# Altium project Trabajo Final.PrjPcb (part 2 of 4)

## Sheet supply.SchDoc
size A4
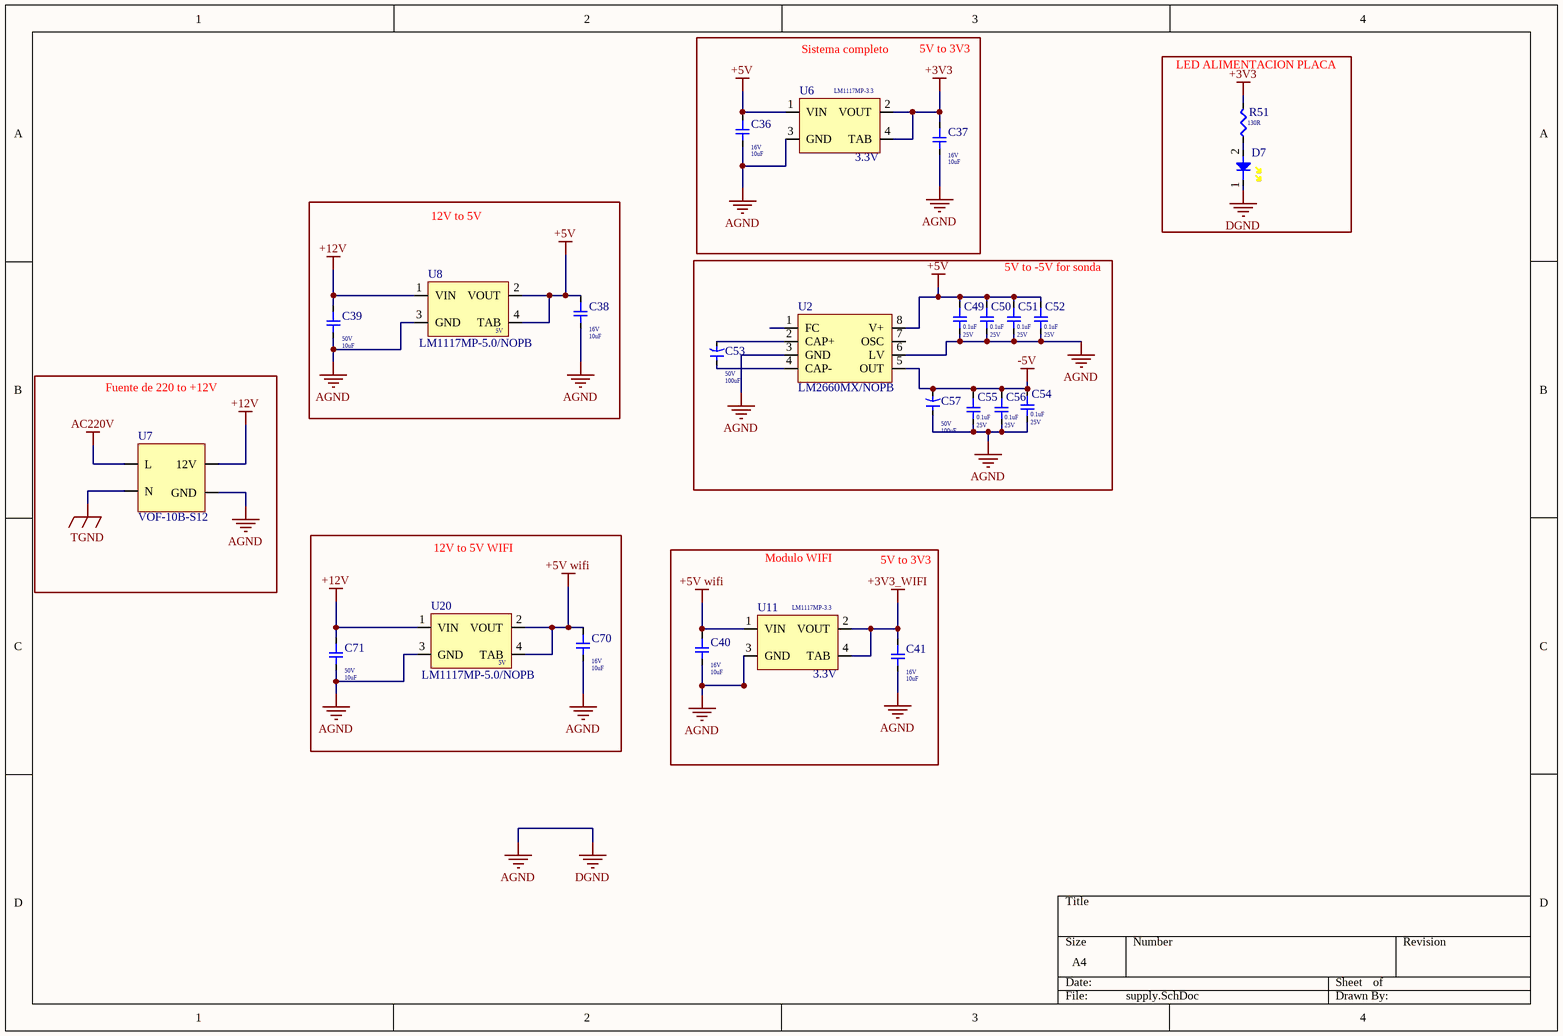
[diagram p1: supply.SchDoc]

### Parts
C36  Voltage Rating: 16V  Capacitance: 10uF  [CAP smd 0805 OK]  (hidden comment: CAP_CL21A106KOCL3RC)
C37  Voltage Rating: 16V  Capacitance: 10uF  [CAP smd 0805 OK]  (hidden comment: CAP_CL21A106KOCL3RC)
C38  Voltage Rating: 16V  Capacitance: 10uF  [CAP smd 0805 OK]  (hidden comment: CAP_CL21A106KOCL3RC)
C39  Voltage Rating: 50V  Capacitance: 10uF  [cap smd 1206 ok]  (hidden comment: CAP_CL31A106MBHNNNE)
C40  Voltage Rating: 16V  Capacitance: 10uF  [CAP smd 0805 OK]  (hidden comment: CAP_CL21A106KOCL3RC)
C41  Voltage Rating: 16V  Capacitance: 10uF  [CAP smd 0805 OK]  (hidden comment: CAP_CL21A106KOCL3RC)
C49  Voltage Rating: 25V  Capacitance: 0.1uF  [CAP smd 0805 ok]  (hidden comment: CAP_CC0805KRX7R8BB104_YAGEO)
C50  Voltage Rating: 25V  Capacitance: 0.1uF  [CAP smd 0805 ok]  (hidden comment: CAP_CC0805KRX7R8BB104_YAGEO)
C51  Voltage Rating: 25V  Capacitance: 0.1uF  [CAP smd 0805 ok]  (hidden comment: CAP_CC0805KRX7R8BB104_YAGEO)
C52  Voltage Rating: 25V  Capacitance: 0.1uF  [CAP smd 0805 ok]  (hidden comment: CAP_CC0805KRX7R8BB104_YAGEO)
C53  Voltage: 50V  Capacitance: 100uF  [cap elec 8x11.5 ok]  (hidden comment: CAP_ESY107M050AG3AA_KEMET)
C54  Voltage Rating: 25V  Capacitance: 0.1uF  [CAP smd 0805 ok]  (hidden comment: CAP_CC0805KRX7R8BB104_YAGEO)
C55  Voltage Rating: 25V  Capacitance: 0.1uF  [CAP smd 0805 ok]  (hidden comment: CAP_CC0805KRX7R8BB104_YAGEO)
C56  Voltage Rating: 25V  Capacitance: 0.1uF  [CAP smd 0805 ok]  (hidden comment: CAP_CC0805KRX7R8BB104_YAGEO)
C57  Voltage: 50V  Capacitance: 100uF  [cap elec 8x11.5 ok]  (hidden comment: CAP_ESY107M050AG3AA_KEMET)
C70  Voltage Rating: 16V  Capacitance: 10uF  [CAP smd 0805 OK]  (hidden comment: CAP_CL21A106KOCL3RC)
C71  Voltage Rating: 50V  Capacitance: 10uF  [cap smd 1206 ok]  (hidden comment: CAP_CL31A106MBHNNNE)
D7  150080YS75000  [Diode smd 0805 yellow ok]  (value not drawn)
R51  Resistance: 130R  [res 0805 ok]  (hidden comment: RC0805FR-07130RL)
U2  LM2660MX/NOPB  [LM2660MX/NOPB ok]
U6  LM1117MP-3.3  Max Output Voltage: 3.3V  [LM1117MP-3.3 ok]
U7  VOF-10B-S12  [12v]
U8  Output Voltage: 5V  [LM1117MP-5.0/NOPB ok]
U11  LM1117MP-3.3  Max Output Voltage: 3.3V  [LM1117MP-3.3 ok]
U20  Output Voltage: 5V  [LM1117MP-5.0/NOPB ok]

### Blocks framed on the sheet
LED ALIMENTACION PLACA: D7 R51
12V to 5V: C38 C39 U8
5V to -5V for sonda: C49-C57 U2
Fuente de 220 to +12V: U7
12V to 5V WIFI: C70 C71 U20

### Nets
+3V3: C37.23 R51.2 U6.2(VOUT) U6.4(TAB)
+3V3_WIFI: C41.23 U11.2(VOUT) U11.4(TAB)
+5V: C36.23 C38.23 C49.23 C50.23 C51.23 C52.23 U2.8(V+) U6.1(VIN) U8.2(VOUT) U8.4(TAB)
+5V wifi: C40.23 C70.23 U11.1(VIN) U20.2(VOUT) U20.4(TAB)
+12V: C39.23 C71.23 U7.3(12V) U8.1(VIN) U20.1(VIN)
-5V: C54.23 C55.23 C56.23 C57.25 U2.5(OUT)
AC220V: U7.2(L)
AGND: C36.22 C37.22 C38.22 C39.22 C40.22 C41.22 C49.22 C50.22 C51.22 C52.22 C54.22 C55.22 C56.22 C57.24 C70.22 C71.22 D7.1 U2.3(GND) U2.6(LV) U6.3(GND) U7.4(GND) U8.3(GND) U11.3(GND) U20.3(GND)  [also labelled DGND]
TGND: U7.1(N)
NetC53_24: C53.24 U2.4(CAP-)
NetC53_25: C53.25 U2.2(CAP+)
NetD7_2: D7.2 R51.1

Not connected (* = marked no-connect by the designer): U2 1(FC) 7(OSC)

### Notes on the sheet
- Sistema completo
- 5V to 3V3
- Modulo WIFI

### Library data of the parts
C36-C38 C40 C41 C70 = CAP_CL21A106KOCL3RC: CAP CER 10UF 16V X5R 0805; Manufacturer 1: Samsung; Tolerance: 10%; Supplier 1: Digi-Key; Manufacturer Part Number 1: CL21A106KOCL3RC; Stock 1: 0; RoHS: Yes; Mount: Surface Mount; Case/Package: 0805; Case Code (Metric): 2012; Case Code (Imperial): 0805; Min Operating Temperature: -55°C; Max Operating Temperature: 85°C; Package Quantity: 1; Packaging: Tape and Reel; Series: CL; Length: 0.079inch; Width: 0.049inch; Thickness: 0.037inch; RoHS Compliant: Yes; ComponentLink1URL: https://datasheet.ciiva.com/25796/cl21a106kocl3rc-25796224.pdf?src-supplier=Digi-Key; ComponentLink1Description: https://datasheet.ciiva.com/25796/cl21a106kocl3rc-25796224.pdf?src-supplier=Digi-Key; Supplier Part Number 1: 1276-2398-2-ND
C39 C71 = CAP_CL31A106MBHNNNE: Cap Ceramic 10uF 50V X5R 20% Pad SMD 1206 85°C T/R; Manufacturer 1: Samsung; Supplier 1: Digi-Key; Manufacturer Part Number 1: CL31A106MBHNNNE; Stock 1: 1423422; Pricing 1: 1=0,31000, 10=0,21300, 50=0,14200, 100=0,12070, 500=0,08520, 1000=0,07455 (USD); RoHS: Yes; Mount: Surface Mount; Case/Package: 1206; Case Code (Metric): 3216; Case Code (Imperial): 1206; Min Operating Temperature: -55°C; Max Operating Temperature: 85°C; Packaging: Tape and Reel; Tolerance: 20%; Dielectric: X5R; Voltage Rating (DC): 50V; Length: 0.126inch; Width: 0.063inch; Thickness: 0.071inch; RoHS Compliant: Yes; ComponentLink1URL: http://www.samsungsem.com/kr/support/product-search/mlcc/CL31A106MBHNNNE.jsp?src-supplier=Digi-Key; ComponentLink1Description: http://www.samsungsem.com/kr/support/product-search/mlcc/CL31A106MBHNNNE.jsp?src-supplier=Digi-Key; Supplier Part Number 1: 1276-6736-1-ND
C49-C52 C54-C56 = CAP_CC0805KRX7R8BB104_YAGEO: CAPACITOR, 0805, 100NF, 25V, REEL 4000; Manufacturer 1: Yageo; Material: Ceramic; Tolerance: 10%; Dielectric: X7R; Insulation Resistance: 100GR; Supplier 1: Digi-Key; Manufacturer Part Number 1: CC0805KRX7R8BB104; Stock 1: 278639; Pricing 1: 1=0,12000, 10=0,08800, 50=0,04980, 100=0,04130, 500=0,02894, 1000=0,02396 (USD); RoHS: Yes; Mount: Surface Mount; Case/Package: 0805; Number of Pins: 2; Case Code (Metric): 2012; Case Code (Imperial): 0805; Min Operating Temperature: -55°C; Max Operating Temperature: 125°C; Package Quantity: 1; Packaging: Tape and Reel; Voltage Rating (DC): 25V; Termination: SMD/SMT; Resistor Type: Ceramic; Series: CC; Length: 2mm; Width: 0.049inch; Height: 0.85mm; Thickness: 0.033inch; Depth: 1.25mm; Radiation Hardening: No; REACH SVHC: No SVHC; Lead Free: Lead Free; Halogen Free: Halogen Free; RoHS Compliant: Yes; ComponentLink1URL: https://datasheet.ciiva.com/8034/70765-8034031.pdf?src-supplier=Element14; ComponentLink1Description: https://datasheet.ciiva.com/8034/70765-8034031.pdf?src-supplier=Element14; ComponentLink2URL: https://datasheet.ciiva.com/28450/1489800-28450789.pdf?src-supplier=Element14; ComponentLink2Description: https://datasheet.ciiva.com/28450/1489800-28450789.pdf?src-supplier=Element14; ComponentLink3URL: https://datasheet.ciiva.com/46430/1850775-46430166.pdf?src-supplier=Element14; ComponentLink3Description: https://datasheet.ciiva.com/46430/1850775-46430166.pdf?src-supplier=Element14; ComponentLink4URL: https://datasheet.ciiva.com/145/mlccorderingcode-145008.pdf?src-supplier=Digi-Key; ComponentLink4Description: https://datasheet.ciiva.com/145/mlccorderingcode-145008.pdf?src-supplier=Digi-Key; ComponentLink5URL: https://datasheet.ciiva.com/145/mlccorderingcode-145007.pdf?src-supplier=Digi-Key; ComponentLink5Description: https://datasheet.ciiva.com/145/mlccorderingcode-145007.pdf?src-supplier=Digi-Key; ComponentLink6URL: https://datasheet.ciiva.com/145/mlccorderingcode-145009.pdf?src-supplier=Digi-Key; ComponentLink6Description: https://datasheet.ciiva.com/145/mlccorderingcode-145009.pdf?src-supplier=Digi-Key; ComponentLink7URL: https://datasheet.ciiva.com/8034/1784427-8034030.pdf?src-supplier=Element14; ComponentLink7Description: https://datasheet.ciiva.com/8034/1784427-8034030.pdf?src-supplier=Element14; ComponentLink8URL: https://datasheet.ciiva.com/8034/1784427-8034029.pdf?src-supplier=Element14; ComponentLink8Description: https://datasheet.ciiva.com/8034/1784427-8034029.pdf?src-supplier=Element14; ComponentLink9URL: https://datasheet.ciiva.com/15189/getdatasheetpartid-330244-15189223.pdf?src-supplier=Verical; ComponentLink9Description: https://datasheet.ciiva.com/15189/getdatasheetpartid-330244-15189223.pdf?src-supplier=Verical; ComponentLink10URL: https://datasheet.ciiva.com/16625/upy-gphc-x7r-6-3v-to-50v-8-16625546.pdf?src-supplier=Avnet+Europe; ComponentLink10Description: https://datasheet.ciiva.com/16625/upy-gphc-x7r-6-3v-to-50v-8-16625546.pdf?src-supplier=Avnet+Europe; Supplier Part Number 1: 311-1141-1-ND
C53 C57 = CAP_ESY107M050AG3AA_KEMET: KEMET - ESY107M050AG3AA - Elektrolytkondensator, 100 µF, 50 V, Produktreihe ESY, ± 20%, Radial bedrahtet, 8 mm; Dielectric Material: Aluminium; Ripple Current: 511mA; Life (Hours): 3000Hour; Leakage Current: 50uA; Dissipation Factor: 0.1%; Lead/Base Style: Straight; Impedance: 74mR; Lead Diameter: 0.6mm; Lead Length: 20mm; Supplier 1: Digi-Key; Manufacturer 1: KEMET; Manufacturer Part Number 1: ESY107M050AG3AA; Stock 1: 587; Pricing 1: 1=0,44000, 10=0,30700, 50=0,21500, 100=0,18420, 500=0,13818, 1000=0,11668, 2500=0,11054, 5000=0,10440 (USD); RoHS: Yes; Mount: Through Hole,PCB; Case/Package: Radial; Min Operating Temperature: -40°C; Max Operating Temperature: 105°C; Tolerance: 20%; Termination: Radial; Packaging: Bulk; Voltage Rating (DC): 50V; Package Quantity: 6000; Voltage Rating: 50V; Series: ESY; ESR (Equivalent Series Resistance): 74mR; Diameter: 8mm; Length: 11mm; Height: 11mm; Lead Pitch: 3.5mm; Height - Seated (Max): 0.492inch; Radiation Hardening: No; RoHS Compliant: Yes; ComponentLink1URL: http://www.farnell.com/datasheets/2751412.pdf?src-supplier=Farnell; ComponentLink1Description: http://www.farnell.com/datasheets/2751412.pdf?src-supplier=Farnell; ComponentLink2URL: http://www.mouser.com/ds/2/212/KEM_A4007_ESY-1103537.pdf?src-supplier=Mouser; ComponentLink2Description: http://www.mouser.com/ds/2/212/KEM_A4007_ESY-1103537.pdf?src-supplier=Mouser; ComponentLink3URL: http://components.arrow.com/part/dataview/0323_06946698?src-supplier=Arrow+Europe; ComponentLink3Description: http://components.arrow.com/part/dataview/0323_06946698?src-supplier=Arrow+Europe; ComponentLink4URL: https://www.alliedelec.com/m/d/2f7883d23207e2a46fd2b27bea013c02.pdf?src-supplier=Allied+Electronics; ComponentLink4Description: https://www.alliedelec.com/m/d/2f7883d23207e2a46fd2b27bea013c02.pdf?src-supplier=Allied+Electronics; ComponentLink5URL: http://uk.rs-online.com/webdocs/13da/0900766b813da6ab.pdf?src-supplier=RSComponents; ComponentLink5Description: http://uk.rs-online.com/webdocs/13da/0900766b813da6ab.pdf?src-supplier=RSComponents; ComponentLink6URL: https://api.kemet.com/component-edge/download/specsheet/ESY107M050AG3AA.pdf?src-supplier=Digi-Key; ComponentLink6Description: https://api.kemet.com/component-edge/download/specsheet/ESY107M050AG3AA.pdf?src-supplier=Digi-Key; ComponentLink7URL: http://capacitoredge.kemet.com/capedge2/DataSheet?pn=ESY107M050AG3AA&src-supplier=Avnet; ComponentLink7Description: http://capacitoredge.kemet.com/capedge2/DataSheet?pn=ESY107M050AG3AA&src-supplier=Avnet; ComponentLink8URL: http://capacitoredge.kemet.com/capedge2/DataSheet/Datasheet-ESY107M050AG3AA.pdf?pn=ESY107M050AG3AA&src-supplier=Onlinecomponents.com; ComponentLink8Description: http://capacitoredge.kemet.com/capedge2/DataSheet/Datasheet-ESY107M050AG3AA.pdf?pn=ESY107M050AG3AA&src-supplier=Onlinecomponents.com; ComponentLink9URL: http://capacitoredge.kemet.com/capedge2/DataSheet?pn=ESY107M050AG3AA&src-supplier=Avnet+Europe; ComponentLink9Description: http://capacitoredge.kemet.com/capedge2/DataSheet?pn=ESY107M050AG3AA&src-supplier=Avnet+Europe; ComponentLink10URL: http://www.farnell.com/datasheets/2751412.pdf?src-supplier=Newark; ComponentLink10Description: http://www.farnell.com/datasheets/2751412.pdf?src-supplier=Newark; Supplier Part Number 1: 399-6119-ND
D7 = 150080YS75000: LED YELLOW CLEAR 0805 SMD; Manufacturer 1: Wurth Electronics; Luminous Intensity: 120mcd; Forward Current: 30mA; Forward Voltage: 2V; Viewing Angle: 140°; Wavelength: 590nm; Lens Style: Clear,Rectangular; Test Current: 20mA; Supplier 1: RSComponents; Manufacturer Part Number 1: 150080YS75000; Stock 1: 9250; Pricing 1: 500=0,09600, 750=0,09200, 1500=0,08700, 3000=0,08300 (GBP); RoHS: Yes; Mount: Surface Mount; Case/Package: 0805; Color: Yellow; Case Code (Metric): 2012; Case Code (Imperial): 0805; Min Operating Temperature: -40°C; Max Operating Temperature: 85°C; Package Quantity: 4000; Packaging: Tape and Reel; Dominant Wavelength: 590nm; Length: 2mm; Width: 1.25mm; Height: 0.7mm; REACH SVHC: Unknown; RoHS Compliant: Yes; ComponentLink1URL: https://datasheet.ciiva.com/23843/150080ys75000-23843256.pdf?src-supplier=Newark; ComponentLink1Description: https://datasheet.ciiva.com/23843/150080ys75000-23843256.pdf?src-supplier=Newark; ComponentLink2URL: https://datasheet.ciiva.com/29279/759438-da-01-en-chipled-0805-w-kl-gelb-150080ys75000-29279034.pdf?src-supplier=Conrad; ComponentLink2Description: https://datasheet.ciiva.com/29279/759438-da-01-en-chipled-0805-w-kl-gelb-150080ys75000-29279034.pdf?src-supplier=Conrad; ComponentLink3URL: https://datasheet.ciiva.com/29563/150080ys75000-29563019.pdf?src-supplier=Digi-Key; ComponentLink3Description: https://datasheet.ciiva.com/29563/150080ys75000-29563019.pdf?src-supplier=Digi-Key; ComponentLink4URL: https://datasheet.ciiva.com/29563/150080ys75000-29563020.pdf?src-supplier=Digi-Key; ComponentLink4Description: https://datasheet.ciiva.com/29563/150080ys75000-29563020.pdf?src-supplier=Digi-Key; ComponentLink5URL: https://datasheet.ciiva.com/29563/150080ys75000-29563021.pdf?src-supplier=Digi-Key; ComponentLink5Description: https://datasheet.ciiva.com/29563/150080ys75000-29563021.pdf?src-supplier=Digi-Key; ComponentLink6URL: https://datasheet.ciiva.com/22656/1911353-22656971.pdf?src-supplier=Element14; ComponentLink6Description: https://datasheet.ciiva.com/22656/1911353-22656971.pdf?src-supplier=Element14; Supplier Part Number 1: 8154231P
R51 = RC0805FR-07130RL: Res Thick Film smd 0805 130 Ohm 1% 0.125W(; Manufacturer 1: Yageo; Power Rating: 125mW; Voltage Rating: 150V; Temperature Coefficient: 100ppm/°C; Supplier 1: Digi-Key; Manufacturer Part Number 1: RC0805FR-07130RL; Stock 1: 289647; Pricing 1: 1=0,10000, 10=0,04200, 100=0,01690, 1000=0,00759, 2500=0,00659 (USD); RoHS: Yes; Mount: Surface Mount; Case/Package: 0805; Case Code (Metric): 2012; Case Code (Imperial): 0805; Size Code: 0805; Min Operating Temperature: -55°C; Max Operating Temperature: 155°C; Tolerance: 1%; Package Quantity: 1; Packaging: Tape and Reel; Resistor Type: Thick Film; Number of Terminations: 2; Termination: SMD/SMT; Max Power Dissipation: 125mW; Voltage Rating (DC): 150V; Features: Moisture Resistant; Series: RC; Technology: THICK FILM; Construction: Rectangular; Length: 2mm; Width: 0.049inch; Height: 0.5mm; Depth: 1.25mm; Military Standard: Not; Lead Free: Lead Free; RoHS Compliant: Yes; ComponentLink1URL: https://datasheet.ciiva.com/11808/0900766b8106beab-11808374.pdf?src-supplier=RSComponents; ComponentLink1Description: https://datasheet.ciiva.com/11808/0900766b8106beab-11808374.pdf?src-supplier=RSComponents; ComponentLink2URL: https://datasheet.ciiva.com/2457/pyu-r-int-thick-7-2457546.pdf?src-supplier=Digi-Key; ComponentLink2Description: https://datasheet.ciiva.com/2457/pyu-r-int-thick-7-2457546.pdf?src-supplier=Digi-Key; ComponentLink3URL: https://datasheet.ciiva.com/2457/pyu-r-int-thick-7-2457547.pdf?src-supplier=Digi-Key; ComponentLink3Description: https://datasheet.ciiva.com/2457/pyu-r-int-thick-7-2457547.pdf?src-supplier=Digi-Key; ComponentLink4URL: https://datasheet.ciiva.com/2457/pyu-r-int-thick-7-2457545.pdf?src-supplier=Digi-Key; ComponentLink4Description: https://datasheet.ciiva.com/2457/pyu-r-int-thick-7-2457545.pdf?src-supplier=Digi-Key; ComponentLink5URL: https://datasheet.ciiva.com/15189/getdatasheetpartid-326400-15189899.pdf?src-supplier=Verical; ComponentLink5Description: https://datasheet.ciiva.com/15189/getdatasheetpartid-326400-15189899.pdf?src-supplier=Verical; ComponentLink6URL: https://datasheet.ciiva.com/16746/rc0805-16746879.pdf?src-supplier=Future+Electronics; ComponentLink6Description: https://datasheet.ciiva.com/16746/rc0805-16746879.pdf?src-supplier=Future+Electronics; Supplier Part Number 1: 311-130CRCT-ND
U2 = LM2660MX/NOPB: Charge Pump INV/STPUP -1.5V to -5.5V 120mA 8-Pin SOIC T/R; Manufacturer 1: TI National Semiconductor; Output Current: 100mA; Logic Function: Inverting; Number of Outputs: 1; Min Supply Voltage: 1.5V; Max Supply Voltage: 5.5V; Switching Frequency: 40kHz; Synchronous Rectifier: No; Quiescent Current: 1mA; Operating Supply Current: 16mA; Supplier 1: Digi-Key; Manufacturer Part Number 1: LM2660MX/NOPB; Stock 1: 13332; Pricing 1: 1=1,66000, 10=1,49400, 25=1,40960, 100=1,20110, 250=1,12784, 500=0,98686, 1000=0,93100 (USD); RoHS: Yes; Mount: Surface Mount; Case/Package: SOIC; Number of Pins: 8; Weight: 0.006596oz; Contact Plating: Tin,Matte; Min Operating Temperature: -40°C; Max Operating Temperature: 85°C; Output Voltage: -5.5V; Packaging: Tape and Reel; Max Input Voltage: 5.5V; Min Input Voltage: 1.5V; Radiation Hardening: No; Lead Free: Lead Free; RoHS Compliant: Yes; ComponentLink1URL: https://datasheet.ciiva.com/26909/getdatasheetpartid-767710-26909758.pdf?src-supplier=Verical; ComponentLink1Description: https://datasheet.ciiva.com/26909/getdatasheetpartid-767710-26909758.pdf?src-supplier=Verical; ComponentLink2URL: https://datasheet.ciiva.com/6594/lm2660-6594222.pdf?src-supplier=Digi-Key; ComponentLink2Description: https://datasheet.ciiva.com/6594/lm2660-6594222.pdf?src-supplier=Digi-Key; Supplier Part Number 1: LM2660MX/NOPBCT-ND
U6 U11 = LM1117MP-3.3: LDO Regulator Pos 3.3V 0.8A 4-Pin(3+Tab) SOT-223 T/R; Manufacturer 1: TI National Semiconductor; Max Input Voltage: 15V; Number of Outputs: 1; Max Output Current: 800mA; Polarity: Positive; Quiescent Current: 10mA; Accuracy: 1%; Output Type: Fixed; Dropout Voltage: 1.2V; Min Input Voltage: 4.5V; Max Supply Voltage: 10V; Min Supply Voltage: 4.75V; Supplier 1: Arrow Electronics; Stock 1: 0; RoHS: No; Mount: Surface Mount; Case/Package: SOT-223; Number of Pins: 4; Min Operating Temperature: 0°C; Max Operating Temperature: 125°C; Output Voltage: 3.3V; Output Current: 800mA; Packaging: Tape and Reel; Nominal Output Voltage: 3.3V; Output Voltage Accuracy: 1%; Voltage: 3.3V; Radiation Hardening: No; REACH SVHC: No SVHC; RoHS Compliant: No; ComponentLink1URL: https://datasheet.ciiva.com/1511/1685500-1511708.pdf?src-supplier=Element14; ComponentLink1Description: https://datasheet.ciiva.com/1511/1685500-1511708.pdf?src-supplier=Element14; ComponentLink2URL: https://datasheet.ciiva.com/26904/lm1117mp-3-3-26904890.pdf?src-supplier=IIIC; ComponentLink2Description: https://datasheet.ciiva.com/26904/lm1117mp-3-3-26904890.pdf?src-supplier=IIIC; ComponentLink3URL: https://datasheet.ciiva.com/14275/lm1117-n-14275231.pdf?src-supplier=Avnet; ComponentLink3Description: https://datasheet.ciiva.com/14275/lm1117-n-14275231.pdf?src-supplier=Avnet; ComponentLink4URL: https://datasheet.ciiva.com/1511/1685500-1511709.pdf?src-supplier=Element14; ComponentLink4Description: https://datasheet.ciiva.com/1511/1685500-1511709.pdf?src-supplier=Element14; Supplier Part Number 1: LM1117MP-3.3; Manufacturer Part Number 1: LM1117MP-3.3
U7 = VOF-10B-S12: AC/DC CONVERTER 12V 10W; Manufacturer 1: CUI; Number of Outputs: 1; Max Output Current: 850mA; Efficiency: 82.32%; Approvals: CE,cURus; Supplier 1: Digi-Key; Manufacturer Part Number 1: VOF-10B-S12; Stock 1: 0; Pricing 1: 1=12,02000, 5=11,85000, 10=11,67900, 25=10,99200, 50=10,64840, 100=10,30500, 250=9,96152, 500=9,61800 (USD); RoHS: Yes; Mount: Through Hole; Min Operating Temperature: -25°C; Max Operating Temperature: 70°C; Voltage - Output 1: 12V; Max Power Dissipation: 10W; RoHS Compliant: Yes; ComponentLink1URL: https://www.cui.com/product/resource/digikeypdf/vof-10b.pdf?src-supplier=Digi-Key; ComponentLink1Description: https://www.cui.com/product/resource/digikeypdf/vof-10b.pdf?src-supplier=Digi-Key; Supplier Part Number 1: 102-4145-ND
U8 U20 = LM1117MP-5.0/NOPB: Space saving 800-mA low-dropout linear regulator with internal current limit 4-SOT-223 0 to 125; Manufacturer 1: TI National Semiconductor; Max Output Current: 800mA; Number of Outputs: 1; Max Input Voltage: 15V; Polarity: Positive; Quiescent Current: 5mA; Accuracy: 1%; Output Type: Fixed; Dropout Voltage: 1.2V; Current Rating: 800A; Min Input Voltage: 2.6V; Max Supply Voltage: 12V; Max Supply Current: 10mA; Power Supply Rejection Ratio (PSRR): 75dB; Supplier 1: Arrow Electronics; Stock 1: 2; Pricing 1: 1=1,08320, 1000=0,48480 (USD); RoHS: Yes; Mount: Surface Mount; Case/Package: SOT-223; Number of Pins: 4; Contact Plating: Tin,Matte; Min Operating Temperature: 0°C; Max Operating Temperature: 125°C; Output Current: 800mA; Packaging: Tape and Reel; Nominal Output Voltage: 5V; Output Voltage Accuracy: 1%; Package Quantity: 1000; Number of Regulators: 1; Min Current Limit: 800mA; Series: -; Output Configuration: Positive; Length: 6.5mm; Width: 3.56mm; Height: 1.6mm; Radiation Hardening: No; REACH SVHC: No SVHC; Lead Free: Lead Free; RoHS Compliant: Yes; ComponentLink1URL: https://datasheet.ciiva.com/15111/getdatasheetpartid-68363-15111331.pdf?src-supplier=Verical; ComponentLink1Description: https://datasheet.ciiva.com/15111/getdatasheetpartid-68363-15111331.pdf?src-supplier=Verical; ComponentLink2URL: https://datasheet.ciiva.com/14149/lm1117-eng-tds-14149981.pdf?src-supplier=Distrelec; ComponentLink2Description: https://datasheet.ciiva.com/14149/lm1117-eng-tds-14149981.pdf?src-supplier=Distrelec; ComponentLink3URL: https://datasheet.ciiva.com/25980/lm1117-n-25980317.pdf?src-supplier=Avnet+Europe; ComponentLink3Description: https://datasheet.ciiva.com/25980/lm1117-n-25980317.pdf?src-supplier=Avnet+Europe; ComponentLink4URL: https://datasheet.ciiva.com/6580/lm1117-n-6580058.pdf?src-supplier=Digi-Key; ComponentLink4Description: https://datasheet.ciiva.com/6580/lm1117-n-6580058.pdf?src-supplier=Digi-Key; ComponentLink5URL: https://datasheet.ciiva.com/6580/lm1117-n-6580053.pdf?src-supplier=Digi-Key; ComponentLink5Description: https://datasheet.ciiva.com/6580/lm1117-n-6580053.pdf?src-supplier=Digi-Key; Supplier Part Number 1: LM1117MP-5.0/NOPB; Manufacturer Part Number 1: LM1117MP-5.0/NOPB

## Sheet perifericos.SchDoc
size A4
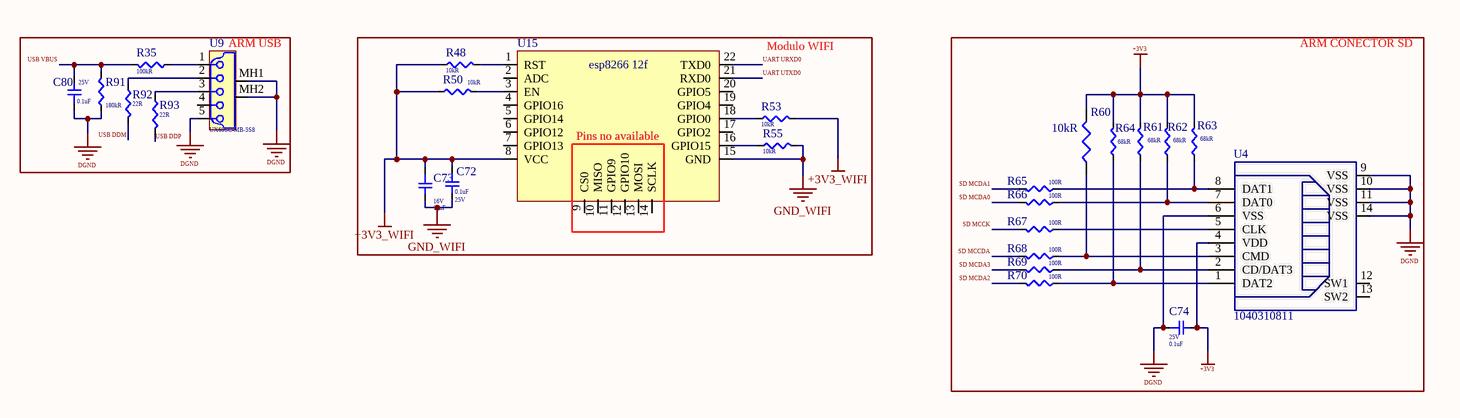
[diagram p2: perifericos.SchDoc]

### Parts
C72  Voltage Rating: 25V  Capacitance: 0.1uF  [CAP smd 0805 ok]  (hidden comment: CAP_CC0805KRX7R8BB104_YAGEO)
C73  Voltage Rating: 16V  Capacitance: 10uF  [CAP smd 0805 OK]  (hidden comment: CAP_CL21A106KOCL3RC)
C74  Voltage Rating: 25V  Capacitance: 0.1uF  [CAP smd 0805 ok]  (hidden comment: CAP_CC0805KRX7R8BB104_YAGEO)
C80  Voltage Rating: 25V  Capacitance: 0.1uF  [CAP smd 0805 ok]  (hidden comment: CAP_CC0805KRX7R8BB104_YAGEO)
R35  Resistance: 100kR  [res 0805 ok]  (hidden comment: AC0805JR-07100KL)
R48  Resistance: 10kR  [res 0805 ok]  (hidden comment: RC0805JR-0710KL)
R50  Resistance: 10kR  [res 0805 ok]  (hidden comment: RC0805JR-0710KL)
R53  Resistance: 10kR  [res 0805 ok]  (hidden comment: RC0805JR-0710KL)
R55  Resistance: 10kR  [res 0805 ok]  (hidden comment: RC0805JR-0710KL)
R60  Resistance: 10kR  [Res 1206 ok]  (hidden comment: RC1206JR-0768KL)
R61  Resistance: 68kR  [Res 1206 ok]  (hidden comment: RC1206JR-0768KL)
R62  Resistance: 68kR  [Res 1206 ok]  (hidden comment: RC1206JR-0768KL)
R63  Resistance: 68kR  [Res 1206 ok]  (hidden comment: RC1206JR-0768KL)
R64  Resistance: 68kR  [Res 1206 ok]  (hidden comment: RC1206JR-0768KL)
R65  Resistance: 100R  [Res 1206 ok]  (hidden comment: RC1206JR-07100RL)
R66  Resistance: 100R  [Res 1206 ok]  (hidden comment: RC1206JR-07100RL)
R67  Resistance: 100R  [Res 1206 ok]  (hidden comment: RC1206JR-07100RL)
R68  Resistance: 100R  [Res 1206 ok]  (hidden comment: RC1206JR-07100RL)
R69  Resistance: 100R  [Res 1206 ok]  (hidden comment: RC1206JR-07100RL)
R70  Resistance: 100R  [Res 1206 ok]  (hidden comment: RC1206JR-07100RL)
R91  Resistance: 180kR  [Res 1206 ok]  (hidden comment: RC1206JR-07180KL)
R92  Resistance: 22R  [res 0805 ok]  (hidden comment: RC0805JR-0722RL)
R93  Resistance: 22R  [res 0805 ok]  (hidden comment: RC0805JR-0722RL)
U4  1040310811  [micro sd]
U9  UX60SC-MB-5S8
U15  esp8266 12f  [modulo wifi ok]

### Blocks framed on the sheet
ARM USB: C80 R35 R91-R93 U9
Modulo WIFI: C72 C73 R48 R50 R53 R55 U15
ARM CONECTOR SD: C74 R60-R70 U4

### Nets
+3V3: C74.22 R60.1 R61.1 R62.1 R63.1 R64.1 U4.4(VDD)
+3V3_WIFI: C72.23 C73.23 R48.2 R50.2 R53.1 U15.8(VCC)
DGND: C74.23 C80.23 R91.2 U4.6(VSS) U4.9(VSS) U4.10(VSS) U4.11(VSS) U4.14(VSS) U9.5 U9.MH1 U9.MH2  [project net AGND]
GND_WIFI: C72.22 C73.22 R55.1 U15.15(GND)
SD MCCDA: R68.1
SD MCCK: R67.1
SD MCDA0: R66.1
SD MCDA1: R65.1
SD MCDA2: R70.1
SD MCDA3: R69.1
UART URXD0: U15.22(TXD0)
UART UTXD0: U15.21(RXD0)
USB DDM: R92.1
USB DDP: R93.1
USB VBUS: C80.22 R35.2 R91.1
NetR35_1: R35.1 U9.1
NetR48_1: R48.1 U15.1(RST)
NetR50_1: R50.1 U15.3(EN)
NetR53_2: R53.2 U15.18(GPIO0)
NetR55_2: R55.2 U15.16(GPIO15)
NetR60_2: R60.2 R68.2 U4.3(CMD)
NetR61_2: R61.2 R69.2 U4.2(CD/DAT3)
NetR62_2: R62.2 R66.2 U4.7(DAT0)
NetR63_2: R63.2 R65.2 U4.8(DAT1)
NetR64_2: R64.2 R70.2 U4.1(DAT2)
NetR67_2: R67.2 U4.5(CLK)
NetR92_2: R92.2 U9.2
NetR93_2: R93.2 U9.3

Not connected (* = marked no-connect by the designer): U4 12(SW1) 13(SW2); U9 4; U15 2(ADC) 4(GPIO16) 5(GPIO14) 6(GPIO12) 7(GPIO13) 9(CS0) 10(MISO) 11(GPIO9) 12(GPIO10) 13(MOSI) 14(SCLK) 17(GPIO2) 19(GPIO4) 20(GPIO5)

### Notes on the sheet
- (in symbol esp8266 12f) Pins no available

### Library data of the parts
C72 C74 C80 = CAP_CC0805KRX7R8BB104_YAGEO: as C49 on sheet supply; Supplier 1: Digi-Key; Manufacturer Part Number 1: CC0805KRX7R8BB104; Stock 1: 278639; Pricing 1: 1=0,12000, 10=0,08800, 50=0,04980, 100=0,04130, 500=0,02894, 1000=0,02396 (USD); RoHS: Yes; Mount: Surface Mount; Case/Package: 0805; Number of Pins: 2; Case Code (Metric): 2012; Case Code (Imperial): 0805; Min Operating Temperature: -55°C; Max Operating Temperature: 125°C; Package Quantity: 1; Packaging: Tape and Reel; Voltage Rating (DC): 25V; Termination: SMD/SMT; Resistor Type: Ceramic; Series: CC; Length: 2mm; Width: 0.049inch; Height: 0.85mm; Thickness: 0.033inch; Depth: 1.25mm; Radiation Hardening: No; REACH SVHC: No SVHC; Lead Free: Lead Free; Halogen Free: Halogen Free; RoHS Compliant: Yes; ComponentLink1URL: https://datasheet.ciiva.com/8034/70765-8034031.pdf?src-supplier=Element14; ComponentLink1Description: https://datasheet.ciiva.com/8034/70765-8034031.pdf?src-supplier=Element14; ComponentLink2URL: https://datasheet.ciiva.com/28450/1489800-28450789.pdf?src-supplier=Element14; ComponentLink2Description: https://datasheet.ciiva.com/28450/1489800-28450789.pdf?src-supplier=Element14; ComponentLink3URL: https://datasheet.ciiva.com/46430/1850775-46430166.pdf?src-supplier=Element14; ComponentLink3Description: https://datasheet.ciiva.com/46430/1850775-46430166.pdf?src-supplier=Element14; ComponentLink4URL: https://datasheet.ciiva.com/145/mlccorderingcode-145008.pdf?src-supplier=Digi-Key; ComponentLink4Description: https://datasheet.ciiva.com/145/mlccorderingcode-145008.pdf?src-supplier=Digi-Key; ComponentLink5URL: https://datasheet.ciiva.com/145/mlccorderingcode-145007.pdf?src-supplier=Digi-Key; ComponentLink5Description: https://datasheet.ciiva.com/145/mlccorderingcode-145007.pdf?src-supplier=Digi-Key; ComponentLink6URL: https://datasheet.ciiva.com/145/mlccorderingcode-145009.pdf?src-supplier=Digi-Key; ComponentLink6Description: https://datasheet.ciiva.com/145/mlccorderingcode-145009.pdf?src-supplier=Digi-Key; ComponentLink7URL: https://datasheet.ciiva.com/8034/1784427-8034030.pdf?src-supplier=Element14; ComponentLink7Description: https://datasheet.ciiva.com/8034/1784427-8034030.pdf?src-supplier=Element14; ComponentLink8URL: https://datasheet.ciiva.com/8034/1784427-8034029.pdf?src-supplier=Element14; ComponentLink8Description: https://datasheet.ciiva.com/8034/1784427-8034029.pdf?src-supplier=Element14; ComponentLink9URL: https://datasheet.ciiva.com/15189/getdatasheetpartid-330244-15189223.pdf?src-supplier=Verical; ComponentLink9Description: https://datasheet.ciiva.com/15189/getdatasheetpartid-330244-15189223.pdf?src-supplier=Verical; ComponentLink10URL: https://datasheet.ciiva.com/16625/upy-gphc-x7r-6-3v-to-50v-8-16625546.pdf?src-supplier=Avnet+Europe; ComponentLink10Description: https://datasheet.ciiva.com/16625/upy-gphc-x7r-6-3v-to-50v-8-16625546.pdf?src-supplier=Avnet+Europe; Supplier Part Number 1: 311-1141-1-ND
C73 = CAP_CL21A106KOCL3RC: as C36 on sheet supply; Supplier 1: Digi-Key; Manufacturer Part Number 1: CL21A106KOCL3RC; Stock 1: 0; RoHS: Yes; Mount: Surface Mount; Case/Package: 0805; Case Code (Metric): 2012; Case Code (Imperial): 0805; Min Operating Temperature: -55°C; Max Operating Temperature: 85°C; Package Quantity: 1; Packaging: Tape and Reel; Series: CL; Length: 0.079inch; Width: 0.049inch; Thickness: 0.037inch; RoHS Compliant: Yes; ComponentLink1URL: https://datasheet.ciiva.com/25796/cl21a106kocl3rc-25796224.pdf?src-supplier=Digi-Key; ComponentLink1Description: https://datasheet.ciiva.com/25796/cl21a106kocl3rc-25796224.pdf?src-supplier=Digi-Key; Supplier Part Number 1: 1276-2398-2-ND
R35 = AC0805JR-07100KL: Thick Film Resistors - SMD 0805  100K ohm 5% 1/8W; Manufacturer 1: Yageo; Power Rating: 125mW; Voltage Rating: 150V; Temperature Coefficient: 100ppm/°C; Supplier 1: Digi-Key; Manufacturer Part Number 1: AC0805JR-07100KL; Stock 1: 23; Pricing 1: 1=0,10000, 10=0,04300, 100=0,01730, 1000=0,00777, 2500=0,00674 (USD); RoHS: Yes; Case/Package: 0805; Case Code (Imperial): 0805; Case Code (Metric): 2012; Weight: 0.000194oz; Min Operating Temperature: -55°C; Max Operating Temperature: 155°C; Tolerance: 5%; Packaging: Tape and Reel; Resistor Type: Thick Film; Number of Terminations: 2; Termination: SMD/SMT; Max Power Dissipation: 125mW; Features: Moisture Resistant,Automotive AEC-Q200; Series: AC; Length: 0.079inch; Width: 0.049inch; Height: 0.024inch; RoHS Compliant: Yes; ComponentLink1URL: https://datasheet.ciiva.com/12576/pyu-ac-51-rohs-l-2-12576604.pdf?src-supplier=Mouser; ComponentLink1Description: https://datasheet.ciiva.com/12576/pyu-ac-51-rohs-l-2-12576604.pdf?src-supplier=Mouser; Supplier Part Number 1: YAG3756CT-ND
R48 R50 R53 R55 = RC0805JR-0710KL: Res Thick Film smd 0805 10K Ohm 5% 1/8W; Manufacturer 1: Yageo; Power Rating: 125mW; Temperature Coefficient: 100ppm/°C; Voltage Rating: 150V; Supplier 1: Digi-Key; Manufacturer Part Number 1: RC0805JR-0710KL; Stock 1: 2124400; Pricing 1: 1=0,10000, 10=0,03600, 100=0,01450, 1000=0,00652, 2500=0,00566 (USD); RoHS: Yes; Case/Package: 0805; Contact Plating: Tin,Matte; Case Code (Imperial): 0805; Case Code (Metric): 2012; Size Code: 0805; Min Operating Temperature: -55°C; Max Operating Temperature: 155°C; Resistor Type: Thick Film; Tolerance: 5%; Packaging: Tape and Reel; Termination: SMD/SMT; Features: Moisture Resistant; Series: RC; Max Power Dissipation: 125mW; Number of Terminations: 2; Resistance Tolerance: 5%; Construction: Rectangular; Length: 2mm; Width: 1.25mm; Height: 0.5mm; Depth: 1.25mm; Radiation Hardening: No; RoHS Compliant: Yes; REACH SVHC: Unknown; Military Standard: Not; Lead Free: Lead Free; ComponentLink1URL: https://datasheet.ciiva.com/7941/444164-7941870.pdf?src-supplier=Element14; ComponentLink1Description: https://datasheet.ciiva.com/7941/444164-7941870.pdf?src-supplier=Element14; ComponentLink2URL: https://datasheet.ciiva.com/7941/444164-7941871.pdf?src-supplier=Element14; ComponentLink2Description: https://datasheet.ciiva.com/7941/444164-7941871.pdf?src-supplier=Element14; ComponentLink3URL: https://datasheet.ciiva.com/7983/444164-7983765.pdf?src-supplier=Element14; ComponentLink3Description: https://datasheet.ciiva.com/7983/444164-7983765.pdf?src-supplier=Element14; Supplier Part Number 1: 311-10KARCT-ND
R60 = RC1206FR-0710KL: Res Thick Film smd 1206 10K Ohm 1% 0.25W(1/4W); Manufacturer 1: Yageo; Power Rating: 250mW; Voltage Rating: 200V; Temperature Coefficient: 100ppm/°C; Supplier 1: Digi-Key; Manufacturer Part Number 1: RC1206FR-0710KL; Stock 1: 845388; Pricing 1: 1=0,10000, 10=0,07400, 100=0,03010, 1000=0,01353, 2500=0,01174 (USD); RoHS: Yes; Case/Package: 1206; Case Code (Imperial): 1206; Case Code (Metric): 3216; Size Code: 1206; Min Operating Temperature: -55°C; Max Operating Temperature: 155°C; Tolerance: 1%; Packaging: Tape and Reel; Termination: SMD/SMT; Resistor Type: Thick Film; Series: RC; Resistance Tolerance: 1%; Features: Moisture Resistant; Max Power Dissipation: 250mW; Number of Terminations: 2; Construction: Rectangular; Package Quantity: 5000; Length: 3.1mm; Width: 1.6mm; Height: 0.55mm; Depth: 1.6mm; REACH SVHC: Unknown; Lead Free: Lead Free; RoHS Compliant: Yes; Military Standard: Not; ComponentLink1URL: https://datasheet.ciiva.com/7857/1692832-7857244.pdf?src-supplier=Element14; ComponentLink1Description: https://datasheet.ciiva.com/7857/1692832-7857244.pdf?src-supplier=Element14; ComponentLink2URL: https://datasheet.ciiva.com/7857/1692832-7857245.pdf?src-supplier=Element14; ComponentLink2Description: https://datasheet.ciiva.com/7857/1692832-7857245.pdf?src-supplier=Element14; ComponentLink3URL: https://datasheet.ciiva.com/46445/444357-46445703.pdf?src-supplier=Element14; ComponentLink3Description: https://datasheet.ciiva.com/46445/444357-46445703.pdf?src-supplier=Element14; Supplier Part Number 1: 311-10.0KFRCT-ND
R61-R64 = RC1206JR-0768KL: Thick Film Resistors smd 1206(3216) 68K OHM 5% 250mW; Manufacturer 1: Yageo; Voltage Rating: 200V; Temperature Coefficient: 100ppm/°C; Supplier 1: Digi-Key; Manufacturer Part Number 1: RC1206JR-0768KL; Stock 1: 38664; Pricing 1: 1=0,10000, 10=0,06300, 100=0,02580, 1000=0,01158, 2500=0,01005 (USD); RoHS: Yes; Case/Package: 1206; Case Code (Imperial): 1206; Case Code (Metric): 3216; Size Code: 1206; Min Operating Temperature: -55°C; Max Operating Temperature: 155°C; Tolerance: 5%; Power Rating: 250mW; Packaging: Tape and Reel; Termination: SMD/SMT; Resistor Type: Thick Film; Features: Moisture Resistant; Series: RC; Max Power Dissipation: 250mW; Number of Terminations: 2; Resistance Tolerance: 5%; Construction: Rectangular; Length: 3.1mm; Depth: 1.6mm; REACH SVHC: No SVHC; Military Standard: Not; Lead Free: Lead Free; RoHS Compliant: Yes; ComponentLink1URL: https://datasheet.ciiva.com/7857/444357-7857527.pdf?src-supplier=Element14; ComponentLink1Description: https://datasheet.ciiva.com/7857/444357-7857527.pdf?src-supplier=Element14; ComponentLink2URL: https://datasheet.ciiva.com/7857/444357-7857528.pdf?src-supplier=Element14; ComponentLink2Description: https://datasheet.ciiva.com/7857/444357-7857528.pdf?src-supplier=Element14; Supplier Part Number 1: 311-68KERCT-ND
R65-R70 = RC1206JR-07100RL: Thick Film Resistors SMD 1206 (3264)  100 OHM 5% 250mW; Manufacturer 1: Yageo; Temperature Coefficient: 100ppm/°C; Voltage Rating: 200V; Supplier 1: Digi-Key; Manufacturer Part Number 1: RC1206JR-07100RL; Stock 1: 1229853; Pricing 1: 1=0,10000, 10=0,06300, 100=0,02580, 1000=0,01158, 2500=0,01005 (USD); RoHS: Yes; Case/Package: 1206; Case Code (Metric): 3216; Case Code (Imperial): 1206; Size Code: 1206; Min Operating Temperature: -55°C; Max Operating Temperature: 155°C; Tolerance: 5%; Resistor Type: Thick Film; Packaging: Tape and Reel; Package Quantity: 5000; Power Rating: 250mW; Number of Terminations: 2; Termination: SMD/SMT; Max Power Dissipation: 250mW; Series: RC1206; Resistance Tolerance: 5%; Construction: Rectangular; Length: 0.122inch; Width: 0.063inch; Height: 0.026inch; Depth: 1.6mm; REACH SVHC: Unknown; Lead Free: Lead Free; Military Standard: Not; RoHS Compliant: Yes; ComponentLink1URL: https://datasheet.ciiva.com/29181/402427-da-01-en-smd-widerstand-chip1206-100-ohm-29181432.pdf?src-supplier=Conrad; ComponentLink1Description: https://datasheet.ciiva.com/29181/402427-da-01-en-smd-widerstand-chip1206-100-ohm-29181432.pdf?src-supplier=Conrad; ComponentLink2URL: https://datasheet.ciiva.com/2458/pyu-rc1206-51-rohs-l-4-2458710.pdf?src-supplier=Digi-Key; ComponentLink2Description: https://datasheet.ciiva.com/2458/pyu-rc1206-51-rohs-l-4-2458710.pdf?src-supplier=Digi-Key; ComponentLink3URL: https://datasheet.ciiva.com/2458/pyu-rc1206-51-rohs-l-4-2458711.pdf?src-supplier=Digi-Key; ComponentLink3Description: https://datasheet.ciiva.com/2458/pyu-rc1206-51-rohs-l-4-2458711.pdf?src-supplier=Digi-Key; ComponentLink4URL: https://datasheet.ciiva.com/2458/pyu-rc1206-51-rohs-l-4-2458712.pdf?src-supplier=Digi-Key; ComponentLink4Description: https://datasheet.ciiva.com/2458/pyu-rc1206-51-rohs-l-4-2458712.pdf?src-supplier=Digi-Key; ComponentLink5URL: https://datasheet.ciiva.com/16772/pyu-rc1206-51-rohs-l-4-16772235.pdf?src-supplier=Future+Electronics; ComponentLink5Description: https://datasheet.ciiva.com/16772/pyu-rc1206-51-rohs-l-4-16772235.pdf?src-supplier=Future+Electronics; Supplier Part Number 1: 311-100ERCT-ND
R91 = RC1206JR-07180KL: RES SMD 1206 180K OHM 5% 1/4W; Manufacturer 1: Yageo; Power Rating: 250mW; Voltage Rating: 200V; Temperature Coefficient: 100ppm/°C; Supplier 1: Newark; Manufacturer Part Number 1: RC1206JR-07180KL; Stock 1: 23350; Pricing 1: 10=0,03100, 25=0,02500, 50=0,01800, 100=0,01100 (USD); RoHS: Yes; Case/Package: 1206; Case Code (Imperial): 1206; Case Code (Metric): 3216; Size Code: 1206; Min Operating Temperature: -55°C; Max Operating Temperature: 155°C; Resistor Type: Thick Film; Tolerance: 5%; Package Quantity: 1; Packaging: Tape and Reel; Termination: SMD/SMT; Number of Terminations: 2; Max Power Dissipation: 250mW; Voltage Rating (DC): 200V; Features: Moisture Resistant; Series: RC; Construction: Rectangular; Length: 3.1mm; Width: 1.6mm; Height: 0.026inch; Depth: 1.6mm; Military Standard: Not; Lead Free: Lead Free; RoHS Compliant: Yes; ComponentLink1URL: https://datasheet.ciiva.com/29181/402818-da-01-en-smd-widerstand-chip1206-180-kohm-29181400.pdf?src-supplier=Conrad; ComponentLink1Description: https://datasheet.ciiva.com/29181/402818-da-01-en-smd-widerstand-chip1206-180-kohm-29181400.pdf?src-supplier=Conrad; ComponentLink2URL: https://datasheet.ciiva.com/2458/pyu-r-int-thick-7-2458890.pdf?src-supplier=Digi-Key; ComponentLink2Description: https://datasheet.ciiva.com/2458/pyu-r-int-thick-7-2458890.pdf?src-supplier=Digi-Key; ComponentLink3URL: https://datasheet.ciiva.com/2458/pyu-r-int-thick-7-2458891.pdf?src-supplier=Digi-Key; ComponentLink3Description: https://datasheet.ciiva.com/2458/pyu-r-int-thick-7-2458891.pdf?src-supplier=Digi-Key; ComponentLink4URL: https://datasheet.ciiva.com/2458/pyu-r-int-thick-7-2458892.pdf?src-supplier=Digi-Key; ComponentLink4Description: https://datasheet.ciiva.com/2458/pyu-r-int-thick-7-2458892.pdf?src-supplier=Digi-Key; ComponentLink5URL: https://datasheet.ciiva.com/17053/pyu-rc1206-51-rohs-l-4-17053351.pdf?src-supplier=Future+Electronics; ComponentLink5Description: https://datasheet.ciiva.com/17053/pyu-rc1206-51-rohs-l-4-17053351.pdf?src-supplier=Future+Electronics; Supplier Part Number 1: 82AH8580
R92 R93 = RC0805JR-0722RL: Res Thick Film smd  0805 22 Ohm 5% 1/8W; Manufacturer 1: Yageo; Temperature Coefficient: 100ppm/°C; Power Rating: 125mW; Voltage Rating: 150V; Supplier 1: Digi-Key; Manufacturer Part Number 1: RC0805JR-0722RL; Stock 1: 938847; Pricing 1: 1=0,10000, 10=0,03600, 100=0,01450, 1000=0,00652, 2500=0,00566 (USD); RoHS: Yes; Case/Package: 0805; Contact Plating: Tin,Matte,Lead; Case Code (Imperial): 0805; Case Code (Metric): 2012; Size Code: 0805; Min Operating Temperature: -55°C; Max Operating Temperature: 155°C; Tolerance: 5%; Resistor Type: Thick Film; Packaging: Tape and Reel; Termination: SMD/SMT; Features: Moisture Resistant; Series: RC; Max Power Dissipation: 125mW; Number of Terminations: 2; Resistance Tolerance: 5%; Construction: Rectangular; Length: 2mm; Depth: 1.25mm; Radiation Hardening: No; REACH SVHC: Unknown; Military Standard: Not; Lead Free: Lead Free; ComponentLink1URL: http://www.mouser.com/ds/2/447/Yageo_08112016_RC0805-968729.pdf?src-supplier=Mouser; ComponentLink1Description: http://www.mouser.com/ds/2/447/Yageo_08112016_RC0805-968729.pdf?src-supplier=Mouser; ComponentLink2URL: http://www.farnell.com/datasheets/2167052.pdf?src-supplier=Farnell; ComponentLink2Description: http://www.farnell.com/datasheets/2167052.pdf?src-supplier=Farnell; ComponentLink3URL: http://components.arrow.com/part/dataview/0323_00047573?src-supplier=Arrow+Europe; ComponentLink3Description: http://components.arrow.com/part/dataview/0323_00047573?src-supplier=Arrow+Europe; ComponentLink4URL: http://www.farnell.com/datasheets/444164.pdf?src-supplier=Farnell; ComponentLink4Description: http://www.farnell.com/datasheets/444164.pdf?src-supplier=Farnell; ComponentLink5URL: http://www.yageo.com/documents/recent/PYu-RC_Group_51_RoHS_L_10.pdf?src-supplier=Digi-Key; ComponentLink5Description: http://www.yageo.com/documents/recent/PYu-RC_Group_51_RoHS_L_10.pdf?src-supplier=Digi-Key; ComponentLink6URL: http://www.yageo.com/documents/recent/PYu-RC_Group_51_RoHS_L_9.pdf?src-supplier=Digi-Key; ComponentLink6Description: http://www.yageo.com/documents/recent/PYu-RC_Group_51_RoHS_L_9.pdf?src-supplier=Digi-Key; ComponentLink7URL: http://www.yageo.com/pdf/PYu-RC0805_51_RoHS_L_4.pdf?src-supplier=Avnet; ComponentLink7Description: http://www.yageo.com/pdf/PYu-RC0805_51_RoHS_L_4.pdf?src-supplier=Avnet; ComponentLink8URL: http://www.yageo.com/documents/recent/PYu-RC0805_51_RoHS_L_5.pdf?src-supplier=Avnet+Europe; ComponentLink8Description: http://www.yageo.com/documents/recent/PYu-RC0805_51_RoHS_L_5.pdf?src-supplier=Avnet+Europe; ComponentLink9URL: http://www.farnell.com/datasheets/442941.pdf?src-supplier=Element14; ComponentLink9Description: http://www.farnell.com/datasheets/442941.pdf?src-supplier=Element14; ComponentLink10URL: http://www.yageo.ru/pdf/RC0805.pdf?src-supplier=Future+Electronics; ComponentLink10Description: http://www.yageo.ru/pdf/RC0805.pdf?src-supplier=Future+Electronics; ComponentLink11URL: http://www.farnell.com/datasheets/2167052.pdf?src-supplier=Newark; ComponentLink11Description: http://www.farnell.com/datasheets/2167052.pdf?src-supplier=Newark; ComponentLink12URL: http://www.farnell.com/datasheets/444164.pdf?src-supplier=Element14; ComponentLink12Description: http://www.farnell.com/datasheets/444164.pdf?src-supplier=Element14; Supplier Part Number 1: 311-22ARCT-ND
U4 = 1040310811: 1.10mm Pitch microSD Memory Card Connector, Surface Mount, Push-Pull Type, 1.42mm Height, with Detect Switch; Manufacturer 1: Molex; Number of Contacts: 8; Current Rating: 500mA; Voltage Rating (AC): 10V; Mating Cycles: 10000; Gender: Female; Pitch: 1.1mm; Supplier 1: Digi-Key; Stock 1: 24019; Pricing 1: 1=2,12000, 10=1,80700, 100=1,49270, 1000=1,17842 (USD); RoHS: Yes; Mount: Standard,Surface Mount; Contact Material: Bronze; Contact Plating: Gold; Housing Material: Polymer; Min Operating Temperature: -25°C; Max Operating Temperature: 85°C; Number of Rows: 1; Orientation: Right Angle; Packaging: Tape and Reel; Package Quantity: 1; Termination: Solder; Connector Type: Connector; Number of Circuits: 8; Series: 104031; Length: 11.14mm; Width: 11.4mm; Height: 1.42mm; Depth: 11.4mm; Radiation Hardening: No; REACH SVHC: Unknown; Halogen Free: Low Halogen; ComponentLink1URL: https://datasheet.ciiva.com/16655/1040310811-memory-card-socket-16655292.pdf?src-supplier=Avnet+Europe; ComponentLink1Description: https://datasheet.ciiva.com/16655/1040310811-memory-card-socket-16655292.pdf?src-supplier=Avnet+Europe; ComponentLink2URL: https://datasheet.ciiva.com/4581/1040310811-memory-card-socket-153593-4581012.pdf?src-supplier=Mouser; ComponentLink2Description: https://datasheet.ciiva.com/4581/1040310811-memory-card-socket-153593-4581012.pdf?src-supplier=Mouser; ComponentLink3URL: https://datasheet.ciiva.com/683/1040310811-sd-683579.pdf?src-supplier=Digi-Key; ComponentLink3Description: https://datasheet.ciiva.com/683/1040310811-sd-683579.pdf?src-supplier=Digi-Key; ComponentLink4URL: https://datasheet.ciiva.com/3121/1040310811-memory-card-socket-3121437.pdf?src-supplier=Avnet; ComponentLink4Description: https://datasheet.ciiva.com/3121/1040310811-memory-card-socket-3121437.pdf?src-supplier=Avnet; ComponentLink5URL: https://datasheet.ciiva.com/15174/getdatasheetpartid-716154-15174887.pdf?src-supplier=Verical; ComponentLink5Description: https://datasheet.ciiva.com/15174/getdatasheetpartid-716154-15174887.pdf?src-supplier=Verical; ComponentLink6URL: https://datasheet.ciiva.com/16496/1040310811-memory-card-socket-16496702.pdf?src-supplier=Avnet+Asia; ComponentLink6Description: https://datasheet.ciiva.com/16496/1040310811-memory-card-socket-16496702.pdf?src-supplier=Avnet+Asia; ComponentLink7URL: https://datasheet.ciiva.com/683/1040310811-sd-683580.pdf?src-supplier=Digi-Key; ComponentLink7Description: https://datasheet.ciiva.com/683/1040310811-sd-683580.pdf?src-supplier=Digi-Key; ComponentLink8URL: https://datasheet.ciiva.com/683/1040310811-sd-683581.pdf?src-supplier=Digi-Key; ComponentLink8Description: https://datasheet.ciiva.com/683/1040310811-sd-683581.pdf?src-supplier=Digi-Key; Manufacturer Part Number 1: 1040310811; Supplier Part Number 1: WM6357CT-ND
U9 = UX60SC-MB-5S8: Conn Mini USB 2.0 Type B RCP 5 POS 0.8mm Solder RA SMD 5 Terminal 1 Port Embossed T/R; Manufacturer 1: Hirose; Number of Terminals/Pins: 5; Gender: Receptacle; Connector Type: USB,Receptacle; Current Rating: 1A; Number of Ports: 1; Insulation Resistance: 100MR; Max Voltage Rating (AC): 5V; USB Standard: USB 2.0; Supplier 1: Digi-Key; Manufacturer Part Number 1: UX60SC-MB-5S8; Stock 1: 15275; Pricing 1: 1=0,99000, 10=0,86700, 25=0,81600, 50=0,78200, 100=0,74800, 250=0,68000, 500=0,61200 (USD); RoHS: Yes; Mount: Surface Mount,Horizontal,Through Hole; Contact Material: Copper Alloy,Copper; Contact Plating: Gold; Min Operating Temperature: -30°C; Max Operating Temperature: 75°C; Package Quantity: 1000; Packaging: Tape and Reel; Number of Contacts: 5; Termination: Solder; Orientation: Right Angle; Series: UX60S; Number of Rows: 1; Max Current Rating: 1A; Number of Positions: 5; Length: 7.7mm; Pitch: 0.8mm; Depth: 7mm; REACH SVHC: No SVHC; Lead Free: Lead Free; ComponentLink1URL: https://datasheet.ciiva.com/22666/1693469-22666928.pdf?src-supplier=Element14; ComponentLink1Description: https://datasheet.ciiva.com/22666/1693469-22666928.pdf?src-supplier=Element14; ComponentLink2URL: https://datasheet.ciiva.com/4598/ed-ux-20140717-4598805.pdf?src-supplier=Mouser; ComponentLink2Description: https://datasheet.ciiva.com/4598/ed-ux-20140717-4598805.pdf?src-supplier=Mouser; ComponentLink3URL: https://datasheet.ciiva.com/15181/getdatasheetpartid-457316-15181367.pdf?src-supplier=Verical; ComponentLink3Description: https://datasheet.ciiva.com/15181/getdatasheetpartid-457316-15181367.pdf?src-supplier=Verical; Supplier Part Number 1: H11589CT-ND